# EasyEDA Pro project PBMCU_C_Hall.epro, schematic Schematic1
Board Name: 主机板子; Create Date: 2024-12-15; Page Name: P1; Project Name: BMCU-V0.6; Schematic Name: Schematic1; Update Date: 2025-03-06; Company: 嘉立创EDA; Page Size: A4; Version: V1.0
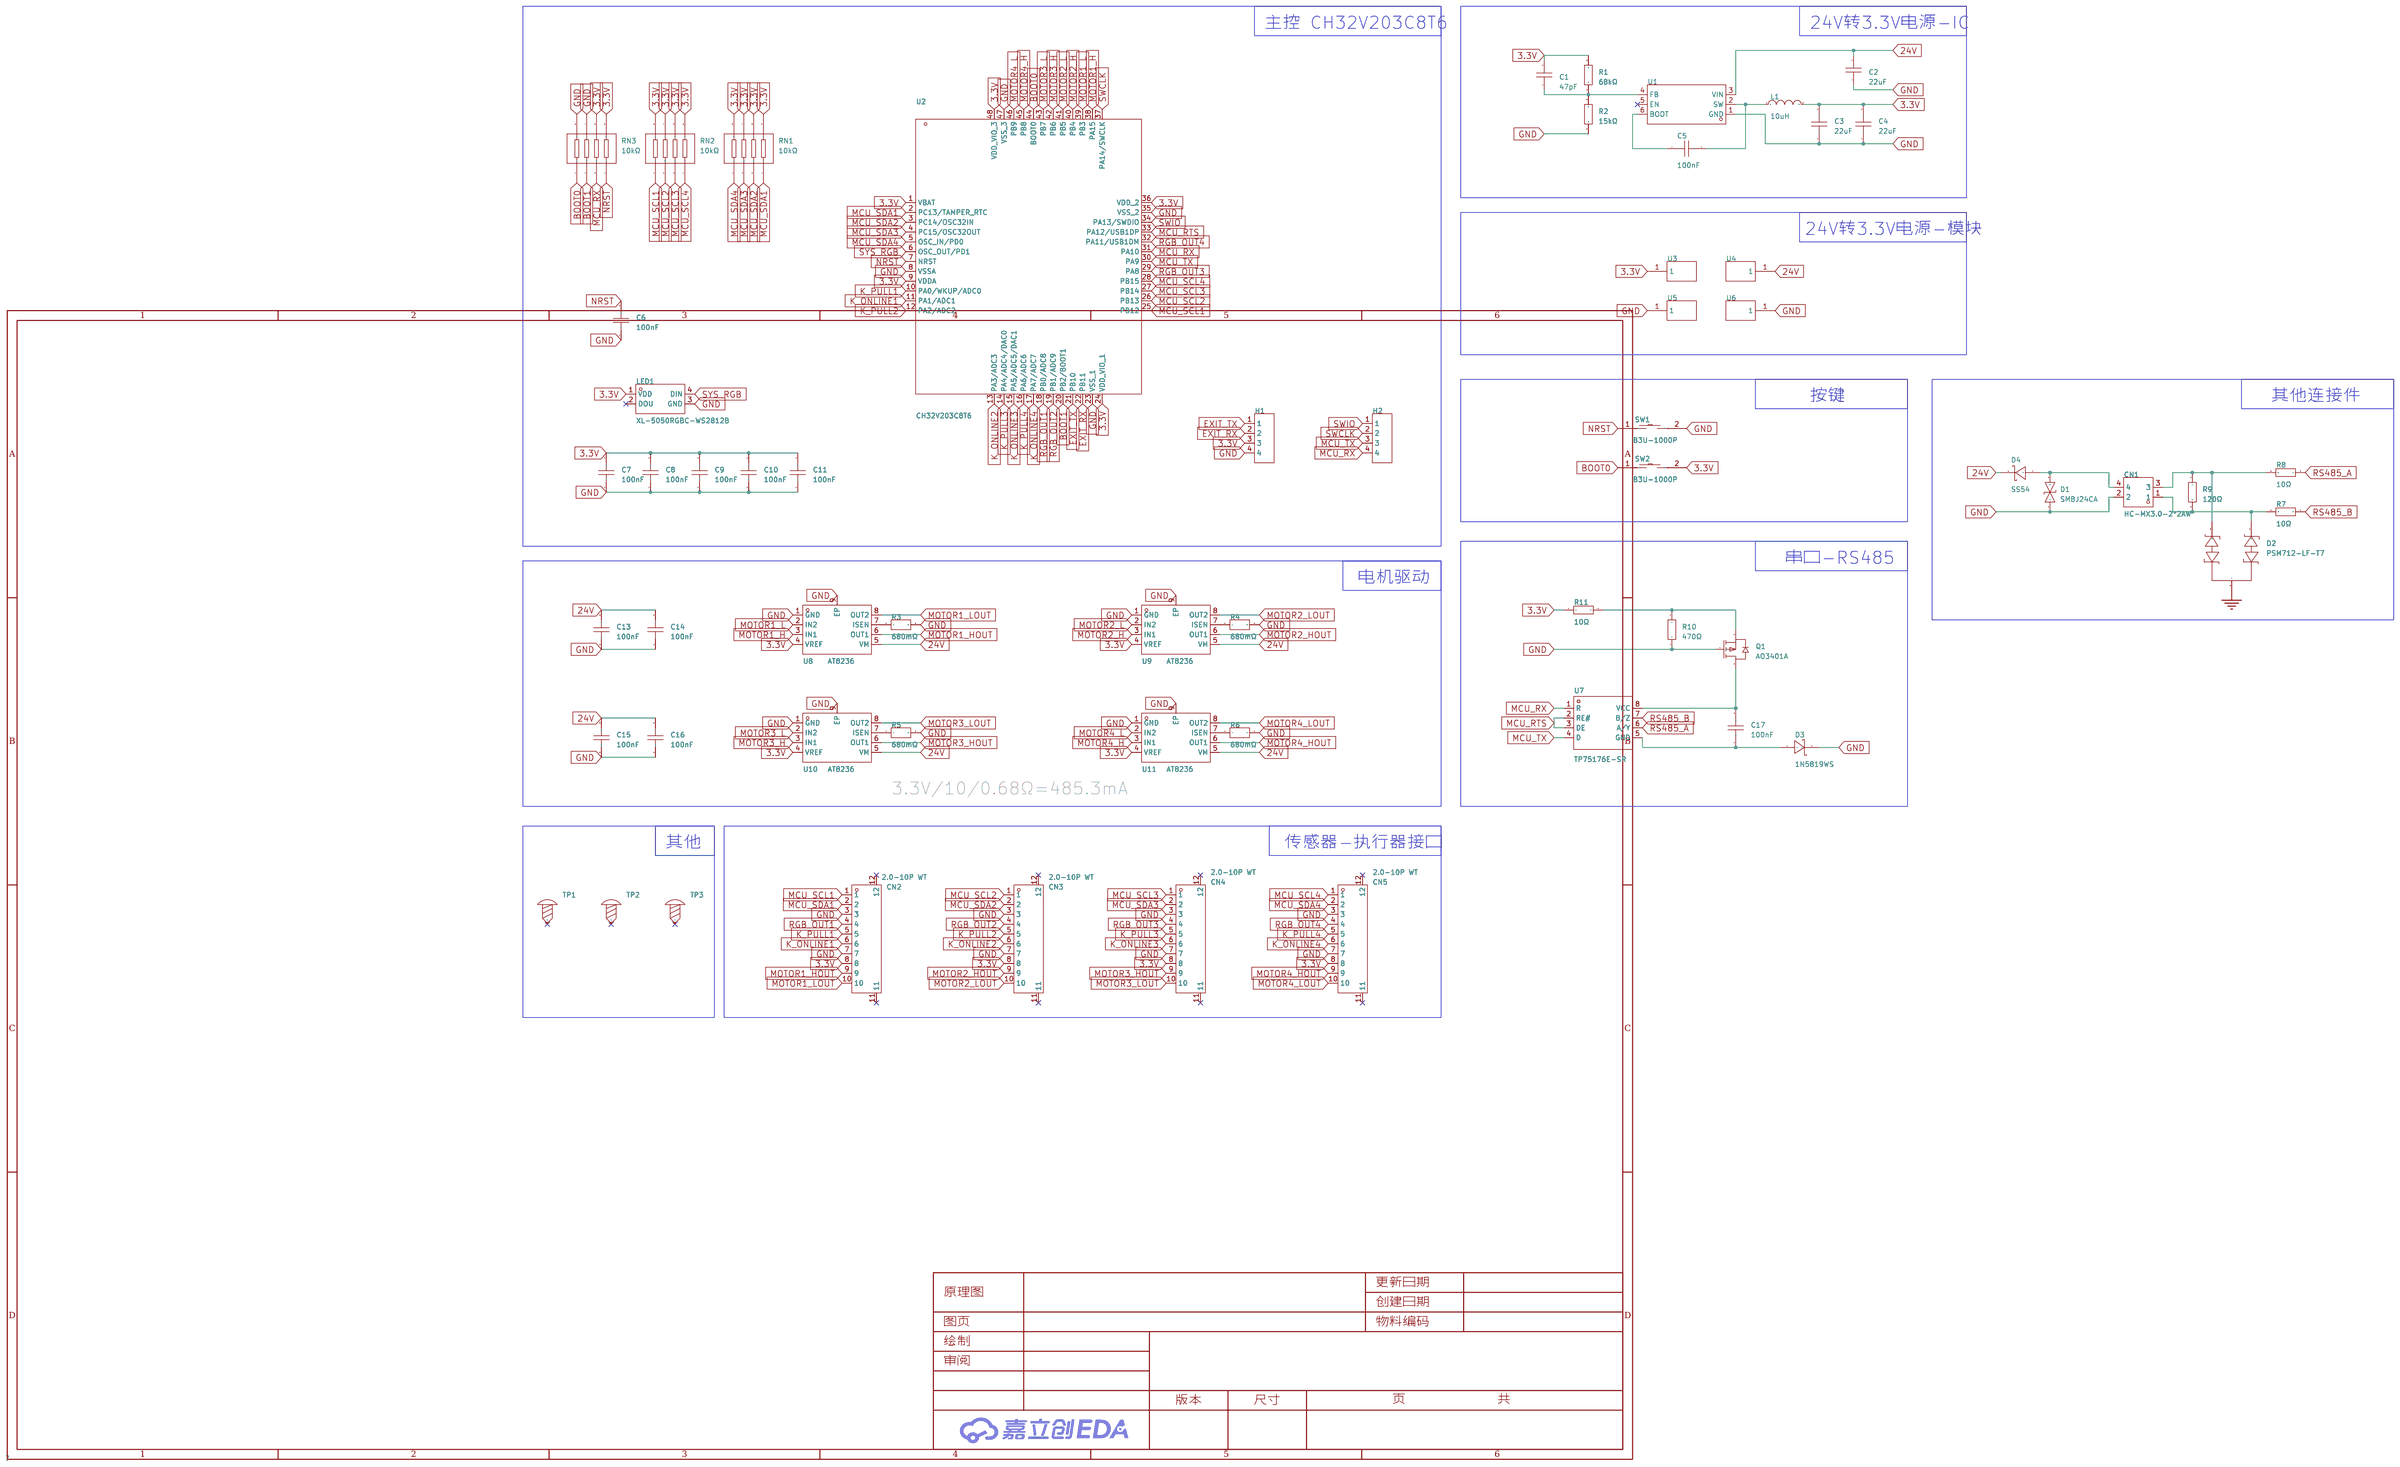
[diagram p0: schematic sheet]

## Parts
C1  47pF  [C0603]
C2  22uF  [C1206]
C3  22uF  [C0805]
C4  22uF  [C0805]
C5  100nF  [C0603]
C6  100nF  [C0603]
C7  100nF  [C0603]
C8  100nF  [C0603]
C9  100nF  [C0603]
C10  100nF  [C0603]
C11  100nF  [C0603]
C13  100nF  [C0603]
C14  100nF  [C0603]
C15  100nF  [C0603]
C16  100nF  [C0603]
C17  100nF  [C0603]
CN1  HC-MX3.0-2*2AW  [CONN-TH_4P-P3.00_HC-MX3.0-2X2AW_1]
CN2  2.0-10P WT  [CONN-SMD_10P-P2.00_2.0-10P-WT]
CN3  2.0-10P WT  [CONN-SMD_10P-P2.00_2.0-10P-WT]
CN4  2.0-10P WT  [CONN-SMD_10P-P2.00_2.0-10P-WT]
CN5  2.0-10P WT  [CONN-SMD_10P-P2.00_2.0-10P-WT]
D1  SMBJ24CA  [SMB_L4.6-W3.6-LS5.3-BI]
D2  PSM712-LF-T7  [SOT-23-3_L3.0-W1.7-P0.95-LS2.9-BR]
D3  1N5819WS  [SOD-323_L1.8-W1.3-LS2.5-RD]
D4  SS54  [SMA_L4.4-W2.8-LS5.4-R-RD]
H1  -  [HDR-TH_4P-P2.54-V-M]
H2  -  [HDR-TH_4P-P2.54-V-M]
L1  10uH  [IND-SMD_L7.3-W6.8]
LED1  XL-5050RGBC-WS2812B  [LED-SMD_4P-L5.0-W5.0-BL_XL-5050RGBC]
Q1  AO3401A  [SOT-23_L2.9-W1.3-P1.90-LS2.4-BR]
R1  68kΩ  [R0603]
R2  15kΩ  [R0603]
R3  680mΩ  [R1210]
R4  680mΩ  [R1210]
R5  680mΩ  [R1210]
R6  680mΩ  [R1210]
R7  10Ω  [R0603]
R8  10Ω  [R0603]
R9  120Ω  [R0603]
R10  470Ω  [R0603]
R11  10Ω  [R0603]
RN1  10kΩ  [RES-ARRAY-SMD_0603-8P-L3.2-W1.6-BL]
RN2  10kΩ  [RES-ARRAY-SMD_0603-8P-L3.2-W1.6-BL]
RN3  10kΩ  [RES-ARRAY-SMD_0603-8P-L3.2-W1.6-BL]
SW1  B3U-1000P  [KEY-SMD_B3U-1000PM]
SW2  B3U-1000P  [KEY-SMD_B3U-1000PM]
TP1  -  [M2螺丝]
TP2  -  [M2螺丝]
TP3  -  [M2螺丝]
U1  TPS54202DDCR  [SOT-23-6_L2.9-W1.6-P0.95-LS2.8-BL]
U2  CH32V203C8T6  [LQFP-48_L7.0-W7.0-P0.50-LS9.0-BL]
U3  -  [SMD 方焊盘 4*5]
U4  -  [SMD 方焊盘 4*5]
U5  -  [SMD 方焊盘 4*5]
U6  -  [SMD 方焊盘 4*5]
U7  TP75176E-SR  [SOP-8_L4.9-W3.9-P1.27-LS6.0-BL]
U8  AT8236  [ESOP-8_L4.9-W3.9-P1.27-LS6.0-BL-EP]
U9  AT8236  [ESOP-8_L4.9-W3.9-P1.27-LS6.0-BL-EP]
U10  AT8236  [ESOP-8_L4.9-W3.9-P1.27-LS6.0-BL-EP]
U11  AT8236  [ESOP-8_L4.9-W3.9-P1.27-LS6.0-BL-EP]

## Library data of the parts
C1 = CL10C470JB8NNNC: 容值:47pF;精度:±5%;额定电压:50V;材质(温度系数):C0G;; LCSC Part Name: 47pF ±5% 50V; Supplier Part: C1671; Manufacturer: SAMSUNG(三星); Supplier Footprint: 0603; JLCPCB Part Class: 基础库; Datasheet: https://atta.szlcsc.com/upload/public/pdf/source/20160218/1457707763339.pdf; Supplier: LCSC; Tolerance: ±5%; Voltage Rated: 50V; Temperature Coefficient: C0G
C2 = CL31A226KAHNNNE: 容值:22uF;精度:±10%;额定电压:25V;材质(温度系数):X5R;; LCSC Part Name: 22uF ±10% 25V; Supplier Part: C12891; Manufacturer: SAMSUNG(三星); Supplier Footprint: 1206; JLCPCB Part Class: 基础库; Datasheet: https://atta.szlcsc.com/upload/public/pdf/source/20160218/1457707763339.pdf; Supplier: LCSC; Tolerance: ±10%; Voltage Rated: 25V; Temperature Coefficient: X5R
C3 C4 = CL21A226MAQNNNE: 容值:22uF;精度:±20%;额定电压:25V;材质(温度系数):X5R;; LCSC Part Name: 22uF ±20% 25V; Supplier Part: C45783; Manufacturer: SAMSUNG(三星); Supplier Footprint: 0805; JLCPCB Part Class: 基础库; Datasheet: https://atta.szlcsc.com/upload/public/pdf/source/20160218/1457707763339.pdf; Supplier: LCSC; Tolerance: ±20%; Voltage Rated: 25V; Temperature Coefficient: X5R
C5-C11 C13-C17 = CC0603KRX7R9BB104: 容值:100nF;精度:±10%;额定电压:50V;材质(温度系数):X7R;; LCSC Part Name: 100nF ±10% 50V; Supplier Part: C14663; Manufacturer: YAGEO(国巨); Supplier Footprint: 0603; JLCPCB Part Class: Basic Part; Datasheet: https://atta.szlcsc.com/upload/public/pdf/source/20180910/C282072_33301C7F631E79921B82A8DAC6BCC5B3.pdf; Supplier: LCSC; Tolerance: ±10%; Voltage Rated: 50V; Temperature Coefficient: X7R
CN1 = HC-MX3.0-2*2AW: 插针结构:2x2P;间距:3mm;安装方式:弯插;参考系列:Micro-Fit(MX 3.0);总PIN数:4P;排数:2;每排PIN数:2;行距:3mm;额定电流:5A;触头材质:黄铜;触头镀层:锡;工作温度范围:-25℃~+85℃;; LCSC Part Name: 2x2P 间距:3mm 弯插 系列:Micro-Fit(MX 3.0); Supplier Part: C3294383; Manufacturer: HCTL(华灿天禄); Supplier Footprint: 弯插,P=3mm; JLCPCB Part Class: Extended Part; Datasheet: https://atta.szlcsc.com/upload/public/pdf/source/20240325/6515A412CF75DC76B766B405583CF347.pdf; Supplier: LCSC; Pins Structure: 2x2P; Pitch: 3mm; Mounting Style: 弯插; Number of Pins: 4P; Number of Rows: 2; Number of PINs Per Row: 2; Row Spacing: 3mm; Current Rating (Max): 5A; Contact Material: 黄铜; Contact Plating: 锡; Operating Temperature Range: -25℃~+85℃; Reference Series: Micro-Fit(MX 3.0); Rated Voltage (Max): 250V; Plastic Material: PA66; Supplementary Features: 鱼叉脚(塑料); Colour: 黑色
CN2-CN5 = 2.0-10P WT: 插针结构:1x10P;间距:2mm;安装方式:卧贴;参考系列:PH;总PIN数:10P;排数:1;每排PIN数:10;额定电流:2A;工作温度范围:-25℃~+85℃;; LCSC Part Name: 间距:2mm 1x10P 卧贴; Supplier Part: C5340818; Manufacturer: SHOU HAN(首韩); Supplier Footprint: SMD,P=2mm,卧贴; Datasheet: https://atta.szlcsc.com/upload/public/pdf/source/20221228/2B469FB976A3BE7FA48F92FFEBDB46D7.pdf; Supplier: LCSC; Pins Structure: 1x10P; Pitch: 2mm; Mounting Style: 卧贴; Reference Series: PH; Number of Pins: 10P; Number of Rows: 1; Number of PINs Per Row: 10; Current Rating (Max): 2A; Operating Temperature Range: -25℃~+85℃
D1 = SMBJ24CA_C693497: 极性:双向;反向截止电压(Vrwm):24V;最大钳位电压:38.9V;峰值脉冲电流(Ipp)@10/1000us:15.5A;击穿电压:38.9V;; Supplier Part: C693497; Manufacturer: FTR(乔光电子); Supplier Footprint: SMB(DO-214AA); JLCPCB Part Class: 扩展库; Datasheet: https://atta.szlcsc.com/upload/public/pdf/source/20200701/C693490_2A1922FF33BB98835C22E740F3EF18EC.pdf; Supplier: LCSC; polarity: 双向; Reverse Stand-Off Voltage (Vrwm): 24V; Maximum Clamping Voltage: 38.9V; Peak Pulse Current (Ipp)@10/1000us: 15.5A; Breakdown Voltage: 38.9V; Type: TVS
D2 = PSM712-LF-T7: 反向截止电压(Vrwm):12V;最大钳位电压:19V;击穿电压:13.3V;; Supplier Part: C32677; Manufacturer: PROTEK; Supplier Footprint: SOT-23; JLCPCB Part Class: 基础库; Datasheet: https://atta.szlcsc.com/upload/public/pdf/source/20140717/1457707154667.pdf; Supplier: LCSC; Reverse Stand-Off Voltage (Vrwm): 12V; Maximum Clamping Voltage: 19V; Breakdown Voltage: 13.3V; Type: TVS
D3 = 1N5819WS_C191023: 正向压降(Vf):600mV@1A;直流反向耐压(Vr):40V;整流电流:1A;; LCSC Part Name: 电压:40V 电流:1A; Supplier Part: C191023; Manufacturer: Hottech(合科泰); Supplier Footprint: SOD-323; Datasheet: https://atta.szlcsc.com/upload/public/pdf/source/20220428/3CB86FD8D28D653594B4E35F9D5AEFD9.pdf; Supplier: LCSC; Forward Voltage (Vf@If): 600mV@1A; Reverse Voltage (Vr): 40V; Rectified Current: 1A
D4 = SS54_C22452: 二极管配置:独立式;正向压降(Vf):550mV@5A;直流反向耐压(Vr):40V;整流电流:5A;; LCSC Part Name: 电压:40V 电流:5A; Supplier Part: C22452; Manufacturer: MDD(辰达半导体); Supplier Footprint: SMA(DO-214AC); Datasheet: https://atta.szlcsc.com/upload/public/pdf/source/20240710/73DFBB65C1883B895E62D589679033DF.pdf; Supplier: LCSC; Diode Configuration: 独立式; Forward Voltage (Vf@If): 550mV@5A; Reverse Voltage (Vr): 40V; Rectified Current: 5A; Reverse Leakage Current (Ir): 1mA@40V
H1 H2 = HDR-M_2.54_1x4P: Supplier Part: C492403; Supplier Footprint: 插件
L1 = FXL0630-100-M: 电感值:10uH;精度:±20%;额定电流:4.5A;饱和电流(Isat):5.5A;类型:一体成型电感;; LCSC Part Name: 10uH ±20% 5.5A; Supplier Part: C167223; Manufacturer: cjiang(长江微电); Supplier Footprint: SMD,6.6x7mm; JLCPCB Part Class: 扩展库; Datasheet: https://atta.szlcsc.com/upload/public/pdf/source/20230516/3A080F5AF8C87BB81C3BA86E5F60E51A.pdf; Supplier: LCSC; Tolerance: ±20%; Rated Current: 4.5A; Saturation Current (Isat): 5.5A; DC Resistance (DCR): 68mΩ; Type: 一体成型电感
LED1 = XL-5050RGBC-WS2812B: 5050七彩幻彩透明贴片LED灯珠 5050 幻彩透明四脚 ws2812B 内置驱动IC; Supplier Part: C2843785; Manufacturer: XINGLIGHT(成兴光); Supplier Footprint: SMD5050; Datasheet: https://atta.szlcsc.com/upload/public/pdf/source/20240412/E1004CAA80592E31D08BFE019083806F.pdf; Supplier: LCSC
Q1 = AO3401A_C347476: 类型:1个P沟道;漏源电压(Vdss):30V;连续漏极电流(Id):4.2A;导通电阻(RDS(on)@Vgs,Id):50mΩ@10V;功率(Pd):1.4W;阈值电压(Vgs(th)@Id):400mV@250uA;; LCSC Part Name: 1个P沟道 耐压:30V 电流:4.2A; Supplier Part: C347476; Manufacturer: UMW(友台半导体); Supplier Footprint: SOT-23; JLCPCB Part Class: 扩展库; Datasheet: https://atta.szlcsc.com/upload/public/pdf/source/20231109/42F312EBB081D72F04A7E8221BFFAF9D.pdf; Supplier: LCSC; Type: 1个P沟道; Drain Source Voltage (Vdss): 30V; Continuous Drain Current (Id): 4.2A; Drain Source On Resistance (RDS(on)@Vgs,Id): 50mΩ@10V; Power Dissipation (Pd): 1.4W; Gate Threshold Voltage (Vgs(th)@Id): 400mV@250uA; Total Gate Charge (Qg@Vgs): 9.4nC@4.5V; Input Capacitance (Ciss@Vds): 954pF; Reverse Transfer Capacitance (Crss@Vds): 77pF; Operating Temperature: -55℃~+150℃
R1 = 0603WAF6802T5E: 电阻类型:厚膜电阻;阻值:68kΩ;精度:±1%;功率:100mW;最大工作电压:75V;温度系数:±100ppm/℃;; LCSC Part Name: 68kΩ ±1% 100mW 厚膜电阻; Supplier Part: C23231; Manufacturer: UNI-ROYAL(厚声); Supplier Footprint: 0603; Datasheet: https://atta.szlcsc.com/upload/public/pdf/source/20200306/C422600_1E6D84923E4A46A82E41ADD87F860B5C.pdf; Supplier: LCSC; Type: 厚膜电阻; Tolerance: ±1%; Power(Watts): 100mW; Overload Voltage (Max): 75V; Temperature Coefficient: ±100ppm/℃; Operating Temperature Range: -55℃~+155℃
R2 = 0603WAF1502T5E: 电阻类型:厚膜电阻;阻值:15kΩ;精度:±1%;功率:100mW;; LCSC Part Name: 15kΩ ±1% 100mW; Supplier Part: C22809; Manufacturer: UNI-ROYAL(厚声); Supplier Footprint: 0603; JLCPCB Part Class: Basic Part; Datasheet: https://atta.szlcsc.com/upload/public/pdf/source/20200306/C422600_1E6D84923E4A46A82E41ADD87F860B5C.pdf; Supplier: LCSC; Type: 厚膜电阻; Tolerance: ±1%; Power(Watts): 100mW; Temperature Coefficient: ±100ppm/℃; Overload Voltage (Max): 75V; Operating Temperature Range: -55℃~+155℃
R3-R6 = 1210W2F680LT5E: 电阻类型:厚膜电阻;阻值:680mΩ;精度:±1%;功率:500mW;最大工作电压:200V;; LCSC Part Name: 680mΩ ±1% 500mW 厚膜电阻; Supplier Part: C620653; Manufacturer: UNI-ROYAL(厚声); Supplier Footprint: 1210; Datasheet: https://atta.szlcsc.com/upload/public/pdf/source/20200306/C422600_1E6D84923E4A46A82E41ADD87F860B5C.pdf; Supplier: LCSC; Type: 厚膜电阻; Tolerance: ±1%; Power(Watts): 500mW; Overload Voltage (Max): 200V; Operating Temperature Range: -55℃~+155℃
R7 R8 R11 = 0603WAF100JT5E: 电阻类型:厚膜电阻;阻值:10Ω;精度:±1%;功率:100mW;最大工作电压:75V;温度系数:±400ppm/℃;; LCSC Part Name: 10Ω ±1% 100mW 厚膜电阻; Supplier Part: C22859; Manufacturer: UNI-ROYAL(厚声); Supplier Footprint: 0603; JLCPCB Part Class: 基础库; Datasheet: https://atta.szlcsc.com/upload/public/pdf/source/20200306/C422600_1E6D84923E4A46A82E41ADD87F860B5C.pdf; Supplier: LCSC; Type: 厚膜电阻; Tolerance: ±1%; Power(Watts): 100mW; Overload Voltage (Max): 75V; Temperature Coefficient: ±400ppm/℃; Operating Temperature Range: -55℃~+155℃
R9 = 0603WAF1200T5E: 电阻类型:厚膜电阻;阻值:120Ω;精度:±1%;功率:100mW;最大工作电压:75V;温度系数:±100ppm/℃;; LCSC Part Name: 120Ω ±1% 100mW 厚膜电阻; Supplier Part: C22787; Manufacturer: UNI-ROYAL(厚声); Supplier Footprint: 0603; Datasheet: https://atta.szlcsc.com/upload/public/pdf/source/20200306/C422600_1E6D84923E4A46A82E41ADD87F860B5C.pdf; Supplier: LCSC; Type: 厚膜电阻; Tolerance: ±1%; Power(Watts): 100mW; Overload Voltage (Max): 75V; Temperature Coefficient: ±100ppm/℃; Operating Temperature Range: -55℃~+155℃
R10 = 0603WAF4700T5E: 电阻类型:厚膜电阻;阻值:470Ω;精度:±1%;功率:100mW;最大工作电压:75V;温度系数:±100ppm/℃;; LCSC Part Name: 470Ω ±1% 100mW 厚膜电阻; Supplier Part: C23179; Manufacturer: UNI-ROYAL(厚声); Supplier Footprint: 0603; Datasheet: https://atta.szlcsc.com/upload/public/pdf/source/20200306/C422600_1E6D84923E4A46A82E41ADD87F860B5C.pdf; Supplier: LCSC; Type: 厚膜电阻; Tolerance: ±1%; Power(Watts): 100mW; Overload Voltage (Max): 75V; Temperature Coefficient: ±100ppm/℃; Operating Temperature Range: -55℃~+155℃
RN1-RN3 = 4D03WGJ0103T5E: 电阻器数:4;阻值:10kΩ;精度:±5%;单个元件功率:62.5mW;温度系数:±200ppm/℃;; LCSC Part Name: 10kΩ ±5%; Supplier Part: C29718; Manufacturer: UNI-ROYAL(厚声); Supplier Footprint: 0603x4; JLCPCB Part Class: 基础库; Datasheet: https://atta.szlcsc.com/upload/public/pdf/source/20191224/C474318_2527498AE30E813171187CCD28401A71.pdf; Supplier: LCSC; Number of Resistors: 4; Tolerance: ±5%; Power(Watts): 62.5mW; Temperature Coefficient: ±200ppm/℃; Number of Pins: 8
SW1 SW2 = B3U-1000P: 触点电流:50mA;额定电压(DC):12V;电路结构:单刀单掷;安装方式:立贴;按钮形状:圆形按钮;带灯:-;开关长度:3mm;开关宽度:2.5mm;开关高度:1.6mm;; Supplier Part: C231329; Manufacturer: OMRON(欧姆龙); Supplier Footprint: SMD,3x2.5mm; JLCPCB Part Class: Extended Part; Datasheet: https://atta.szlcsc.com/upload/public/pdf/source/20180629/C231329_070179C33643744C5978F4F02109B85D.pdf; Supplier: LCSC; Contact Current: 50mA; Voltage Rating (DC): 12V; Circuit: 单刀单掷; Mounting Style: 立贴; Actuator Style: 圆形按钮; Switch Length: 3mm; Switch Width: 2.5mm; Switch Height: 1.6mm
TP1-TP3 = M2螺丝: Supplier Footprint: 插件
U1 = TPS54202DDCR: 可输出电流:2A;开关工作频率:500kHz;输出类型:Adjustable;输出电压的路数:1;功能类型:Step-Down;输出配置:Positive;; Supplier Part: C191884; Manufacturer: TI(德州仪器); Supplier Footprint: SOT-23-6; JLCPCB Part Class: Extended Part; Datasheet: https://atta.szlcsc.com/upload/public/pdf/source/20181012/C191884_C6DBFD980275651BD8C8F427C2E48058.pdf; Supplier: LCSC; NO_CONNECT: yes
U2 = CH32V203C8T6: CPU内核:RISC-V;程序存储容量:64KB;RAM总容量:20KB;GPIO端口数量:-;工作电压范围:-;CPU最大主频:144MHz;程序存储器类型:FLASH;; Supplier Part: C3001172; Manufacturer: WCH(南京沁恒); Supplier Footprint: LQFP-48(7x7); Datasheet: https://atta.szlcsc.com/upload/public/pdf/source/20220425/D3E728E801B9982E2758AC225E3A30F9.pdf; Supplier: LCSC; CPU Core: RISC-V; Program Storage Size: 64KB; RAM Size: 20KB; CPU Maximum Speed: 144MHz; Program Memory Type: FLASH
U3-U6 = 方焊盘 4*5: Check: false
U7 = TP75176E-SR: 类型:收发器;数据速率:10Mbps;驱动器/接收器:1/1;; LCSC Part Name: 3V~5.5V供电 10Mbps 收发器; Supplier Part: C94207; Manufacturer: 3PEAK; Supplier Footprint: SOP-8; JLCPCB Part Class: 扩展库; Datasheet: https://atta.szlcsc.com/upload/public/pdf/source/20170228/1488267657599.pdf; Supplier: LCSC; Types: 收发器; Supply Voltage: 3V~5.5V; Data Rate: 10Mbps; Driver/receiver: 1/1
U8-U11 = AT8236: Supplier Part: C2827823; Manufacturer: 杭州中科微; Supplier Footprint: ESOP-8; Datasheet: https://atta.szlcsc.com/upload/public/pdf/source/20210923/1552D95CBAF8BE780D06AE79E7783380.pdf; Supplier: LCSC

## Nets
3.3V: C1.2 C3.2 C4.2 C7.2 C8.2 C9.2 C10.2 C11.2 CN2.8 CN3.8 CN4.8 CN5.8 H1.3 L1.2 LED1.1(VDD) R1.2 R11.1 RN1.5 RN1.6 RN1.7 RN1.8 RN2.5 RN2.6 RN2.7 RN2.8 RN3.5 RN3.6 SW2.2 U2.1(VBAT) U2.9(VDDA) U2.24(VDD_VIO_1) U2.36(VDD_2) U2.48(VDD_VIO_3) U3.1 U8.4(VREF) U9.4(VREF) U10.4(VREF) U11.4(VREF)
24V: C2.2 C13.2 C14.2 C15.2 C16.2 D4.2(K) U1.3(VIN) U4.1 U8.5(VM) U9.5(VM) U10.5(VM) U11.5(VM)
GND: C2.1 C3.1 C4.1 C6.1 C7.1 C8.1 C9.1 C10.1 C11.1 C13.1 C14.1 C15.1 C16.1 CN1.2 CN2.3 CN2.7 CN3.3 CN3.7 CN4.3 CN4.7 CN5.3 CN5.7 D1.1 D2.3(K) D3.1(K) H1.4 LED1.3(GND) Q1.1(G) R2.1 R3.2 R4.2 R5.2 R6.2 R10.1 RN3.7 RN3.8 SW1.2 U1.1(GND) U2.8(VSSA) U2.23(VSS_1) U2.35(VSS_2) U2.47(VSS_3) U5.1 U6.1 U8.1(GND) U8.9(EP) U9.1(GND) U9.9(EP) U10.1(GND) U10.9(EP) U11.1(GND) U11.9(EP)
BOOT0: RN3.1 SW2.1 U2.44(BOOT0)
BOOT1: RN3.2 U2.20(PB2/BOOT1)
EXIT_RX: H1.2 U2.22(PB11)
EXIT_TX: H1.1 U2.21(PB10)
K_ONLINE1: CN2.6 U2.11(PA1/ADC1)
K_ONLINE2: CN3.6 U2.13(PA3/ADC3)
K_ONLINE3: CN4.6 U2.15(PA5/ADC5/DAC1)
K_ONLINE4: CN5.6 U2.17(PA7/ADC7)
K_PULL1: CN2.5 U2.10(PA0/WKUP/ADC0)
K_PULL2: CN3.5 U2.12(PA2/ADC2)
K_PULL3: CN4.5 U2.14(PA4/ADC4/DAC0)
K_PULL4: CN5.5 U2.16(PA6/ADC6)
MCU_RTS: U2.33(PA12/USB1DP) U7.2(RE#) U7.3(DE)
MCU_RX: H2.4 RN3.3 U2.31(PA10) U7.1(R)
MCU_SCL1: CN2.1 RN2.1 U2.25(PB12)
MCU_SCL2: CN3.1 RN2.2 U2.26(PB13)
MCU_SCL3: CN4.1 RN2.3 U2.27(PB14)
MCU_SCL4: CN5.1 RN2.4 U2.28(PB15)
MCU_SDA1: CN2.2 RN1.4 U2.2(PC13/TAMPER_RTC)
MCU_SDA2: CN3.2 RN1.3 U2.3(PC14/OSC32IN)
MCU_SDA3: CN4.2 RN1.2 U2.4(PC15/OSC32OUT)
MCU_SDA4: CN5.2 RN1.1 U2.5(OSC_IN/PD0)
MCU_TX: H2.3 U2.30(PA9) U7.4(D)
MOTOR1_H: U2.38(PA15) U8.3(IN1)
MOTOR1_HOUT: CN2.9 U8.6(OUT1)
MOTOR1_L: U2.39(PB3) U8.2(IN2)
MOTOR1_LOUT: CN2.10 U8.8(OUT2)
MOTOR2_H: U2.40(PB4) U9.3(IN1)
MOTOR2_HOUT: CN3.9 U9.6(OUT1)
MOTOR2_L: U2.41(PB5) U9.2(IN2)
MOTOR2_LOUT: CN3.10 U9.8(OUT2)
MOTOR3_H: U2.42(PB6) U10.3(IN1)
MOTOR3_HOUT: CN4.9 U10.6(OUT1)
MOTOR3_L: U2.43(PB7) U10.2(IN2)
MOTOR3_LOUT: CN4.10 U10.8(OUT2)
MOTOR4_H: U2.45(PB8) U11.3(IN1)
MOTOR4_HOUT: CN5.9 U11.6(OUT1)
MOTOR4_L: U2.46(PB9) U11.2(IN2)
MOTOR4_LOUT: CN5.10 U11.8(OUT2)
NRST: C6.2 RN3.4 SW1.1 U2.7(NRST)
RGB_OUT1: CN2.4 U2.18(PB0/ADC8)
RGB_OUT2: CN3.4 U2.19(PB1/ADC9)
RGB_OUT3: CN4.4 U2.29(PA8)
RGB_OUT4: CN5.4 U2.32(PA11/USB1DM)
RS485_A: R8.1 U7.6(A/Y)
RS485_B: R7.1 U7.7(B/Z)
SWCLK: H2.2 U2.37(PA14/SWCLK)
SWIO: H2.1 U2.34(PA13/SWDIO)
SYS_RGB: LED1.4(DIN) U2.6(OSC_OUT/PD1)
$1N1340: C17.1 D3.2(A) U7.5(GND)
$1N2752: C5.2 L1.1 U1.2(SW)
$1N2756: C5.1 U1.6(BOOT)
$1N6554: C1.1 R1.1 R2.2 U1.4(FB)
$1N17664: R3.1 U8.7(ISEN)
$1N17864: R4.1 U9.7(ISEN)
$1N18070: R5.1 U10.7(ISEN)
$1N18276: R6.1 U11.7(ISEN)
$1N22933: CN1.1 D2.1(A1) R7.2 R9.2
$1N22936: CN1.3 D2.2(A1) R8.2 R9.1
$1N32139: Q1.2(S) R10.2 R11.2
$1N32182: C17.2 Q1.3(D) U7.8(VCC)
$1N32717: CN1.4 D1.2 D4.1(A)

Not connected (* = marked no-connect by the designer): CN2 11* 12*; CN3 11* 12*; CN4 11* 12*; CN5 11* 12*; LED1 2(DOU)*; TP1 1*; TP2 1*; TP3 1*; U1 5(EN)*

## Notes on the sheet
- 主控 CH32V203C8T6
- 24V转3.3V电源-IC
- 24V转3.3V电源-模块
- 按键
- 其他连接件
- 串口-RS485
- 电机驱动
- 3.3V/10/0.68Ω=485.3mA
- 其他
- 传感器-执行器接口
